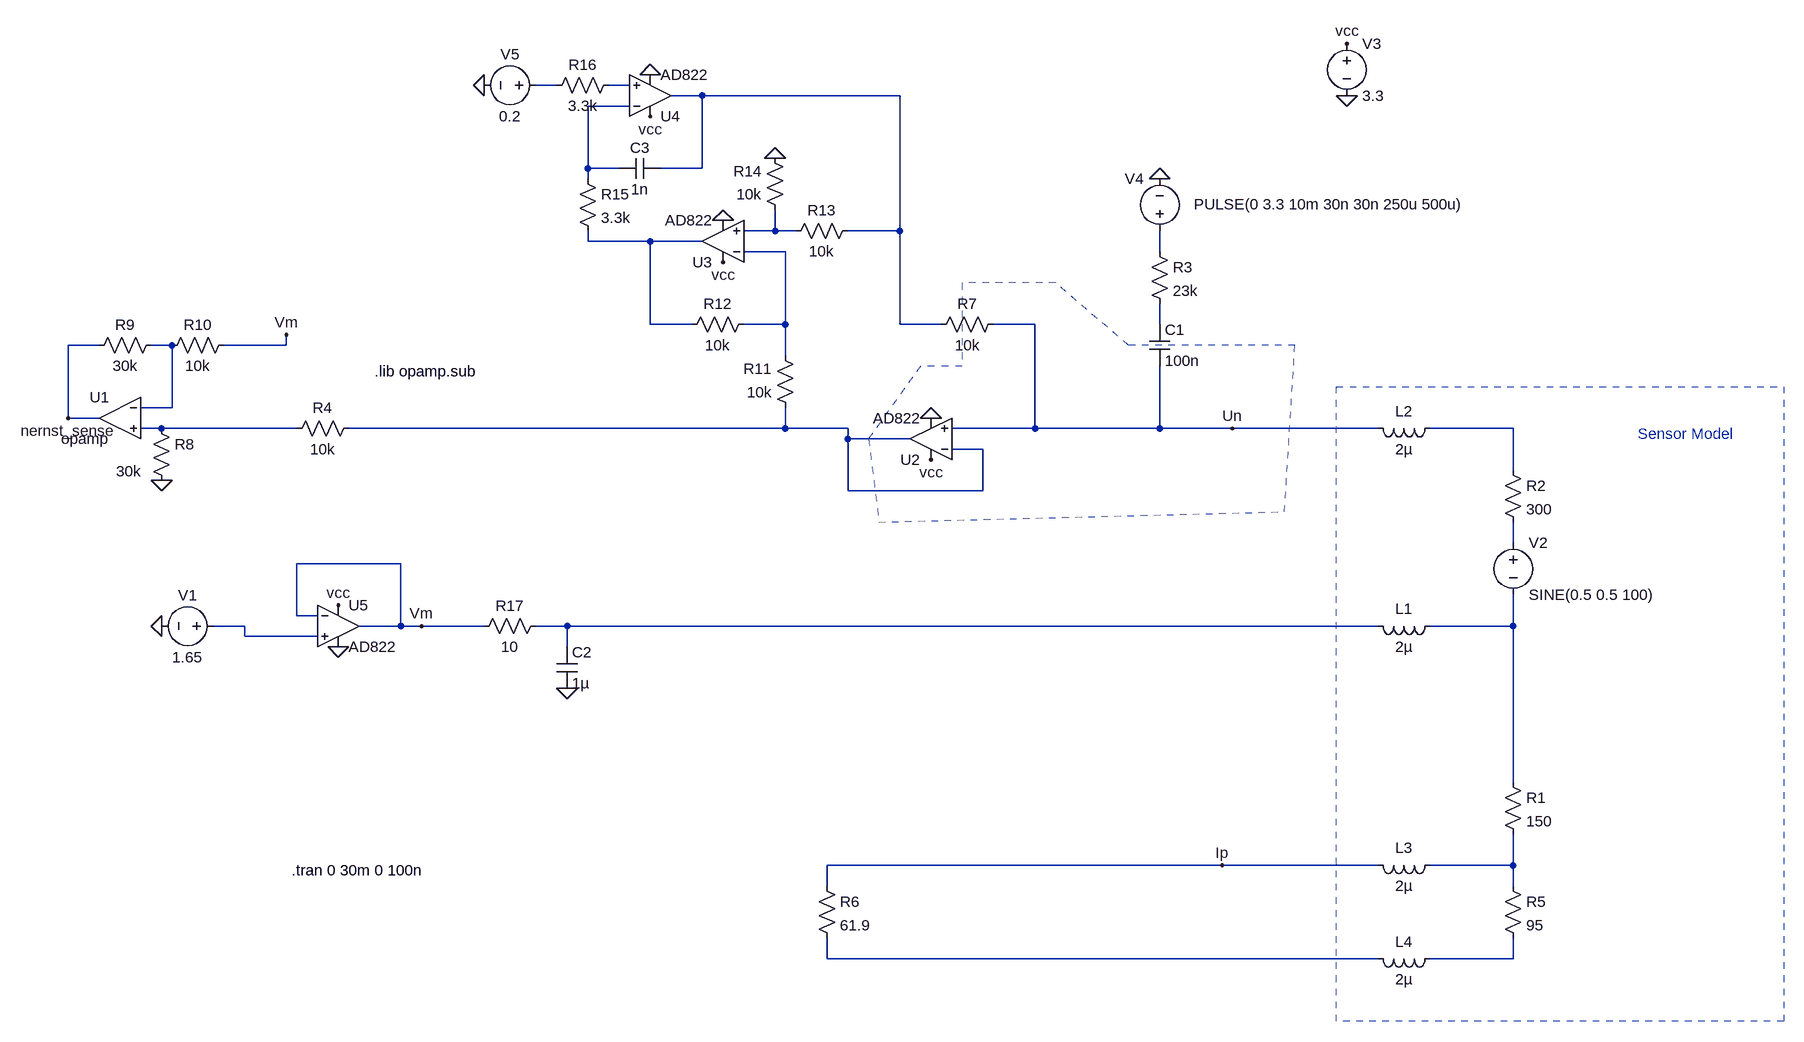
[diagram p0: schematic NernstSenseModel.asc]
NernstSenseModel.asc, the LTspice schematic file:
Version 4
SHEET 1 2244 772
WIRE 352 -672 320 -672
WIRE 464 -672 432 -672
WIRE 576 -656 528 -656
WIRE 880 -656 576 -656
WIRE 464 -640 400 -640
WIRE 400 -544 400 -640
WIRE 448 -544 400 -544
WIRE 576 -544 576 -656
WIRE 576 -544 512 -544
WIRE 400 -528 400 -544
WIRE 688 -448 688 -480
WIRE 688 -448 640 -448
WIRE 720 -448 688 -448
WIRE 880 -448 880 -656
WIRE 880 -448 800 -448
WIRE 400 -432 400 -448
WIRE 496 -432 400 -432
WIRE 576 -432 496 -432
WIRE 704 -416 640 -416
WIRE 1280 -416 1280 -448
WIRE 496 -304 496 -432
WIRE 560 -304 496 -304
WIRE 704 -304 704 -416
WIRE 704 -304 640 -304
WIRE 880 -304 880 -448
WIRE 944 -304 880 -304
WIRE 1088 -304 1024 -304
WIRE 1280 -304 1280 -336
WIRE -352 -272 -400 -272
WIRE -240 -272 -272 -272
WIRE -64 -272 -64 -288
WIRE -64 -272 -160 -272
WIRE 704 -256 704 -304
WIRE -240 -176 -240 -272
WIRE -240 -176 -288 -176
WIRE -400 -160 -400 -272
WIRE -352 -160 -400 -160
WIRE -256 -144 -288 -144
WIRE -48 -144 -256 -144
WIRE 704 -144 704 -176
WIRE 704 -144 32 -144
WIRE 800 -144 704 -144
WIRE 1088 -144 1088 -304
WIRE 1088 -144 960 -144
WIRE 1280 -144 1280 -240
WIRE 1280 -144 1088 -144
WIRE 1392 -144 1280 -144
WIRE 1616 -144 1392 -144
WIRE 1824 -144 1696 -144
WIRE 800 -128 800 -144
WIRE 896 -128 800 -128
WIRE 1008 -112 960 -112
WIRE 1824 -80 1824 -144
WIRE 800 -48 800 -128
WIRE 1008 -48 1008 -112
WIRE 1008 -48 800 -48
WIRE 1824 32 1824 0
WIRE 112 64 -48 64
WIRE -48 144 -48 64
WIRE -16 144 -48 144
WIRE -128 160 -176 160
WIRE 112 160 112 64
WIRE 112 160 48 160
WIRE 144 160 112 160
WIRE 240 160 144 160
WIRE 368 160 320 160
WIRE 1616 160 368 160
WIRE 1824 160 1824 112
WIRE 1824 160 1696 160
WIRE -128 176 -128 160
WIRE -16 176 -128 176
WIRE 368 192 368 160
WIRE 1824 400 1824 160
WIRE 1376 528 768 528
WIRE 1616 528 1376 528
WIRE 1824 528 1824 480
WIRE 1824 528 1696 528
WIRE 768 560 768 528
WIRE 1824 560 1824 528
WIRE 768 672 768 640
WIRE 1616 672 768 672
WIRE 1824 672 1824 640
WIRE 1824 672 1696 672
FLAG -256 160 0
FLAG 1280 -528 0
FLAG 1392 -144 Un
FLAG 1376 528 Ip
FLAG -64 -288 Vm
FLAG -256 -64 0
FLAG -400 -160 nernst_sense
FLAG 1568 -656 0
FLAG 1568 -736 vcc
FLAG 928 -96 vcc
FLAG 928 -160 0
FLAG 496 -688 0
FLAG 688 -560 0
FLAG 240 -672 0
FLAG 496 -624 vcc
FLAG 608 -400 vcc
FLAG 608 -464 0
FLAG 144 160 Vm
FLAG 368 256 0
FLAG 16 192 0
FLAG 16 128 vcc
SYMBOL voltage -160 160 R90
WINDOW 0 -32 56 VBottom 2
WINDOW 3 32 56 VTop 2
WINDOW 123 0 0 Left 0
WINDOW 39 0 0 Left 0
SYMATTR InstName V1
SYMATTR Value 1.65
SYMBOL res 1808 384 R0
SYMATTR InstName R1
SYMATTR Value 150
SYMBOL voltage 1824 16 R0
WINDOW 123 0 0 Left 0
WINDOW 39 0 0 Left 0
SYMATTR InstName V2
SYMATTR Value SINE(0.5 0.5 100)
SYMBOL res 1808 -96 R0
SYMATTR InstName R2
SYMATTR Value 300
SYMBOL cap 1264 -304 R0
SYMATTR InstName C1
SYMATTR Value 100n
SYMBOL res 1264 -432 R0
SYMATTR InstName R3
SYMATTR Value 23k
SYMBOL voltage 1280 -432 R180
WINDOW 0 24 96 Left 2
WINDOW 3 -471 57 Left 2
WINDOW 123 0 0 Left 0
WINDOW 39 0 0 Left 0
SYMATTR InstName V4
SYMATTR Value PULSE(0 3.3 10m 30n 30n 250u 500u)
SYMBOL res 1808 544 R0
SYMATTR InstName R5
SYMATTR Value 95
SYMBOL res 752 544 R0
SYMATTR InstName R6
SYMATTR Value 61.9
SYMBOL Opamps\\opamp -320 -224 M0
SYMATTR InstName U1
SYMBOL res 48 -160 R90
WINDOW 0 0 56 VBottom 2
WINDOW 3 32 56 VTop 2
SYMATTR InstName R4
SYMATTR Value 10k
SYMBOL res -272 -160 R0
WINDOW 3 -54 82 Left 2
SYMATTR Value 30k
SYMATTR InstName R8
SYMBOL res -256 -288 R90
WINDOW 0 0 56 VBottom 2
WINDOW 3 32 56 VTop 2
SYMATTR InstName R9
SYMATTR Value 30k
SYMBOL res -144 -288 R90
WINDOW 0 0 56 VBottom 2
WINDOW 3 32 56 VTop 2
SYMATTR InstName R10
SYMATTR Value 10k
SYMBOL ind 1712 144 R90
WINDOW 0 5 56 VBottom 2
WINDOW 3 32 56 VTop 2
SYMATTR InstName L1
SYMATTR Value 2µ
SYMBOL ind 1712 -160 R90
WINDOW 0 5 56 VBottom 2
WINDOW 3 32 56 VTop 2
SYMATTR InstName L2
SYMATTR Value 2µ
SYMBOL ind 1712 512 R90
WINDOW 0 5 56 VBottom 2
WINDOW 3 32 56 VTop 2
SYMATTR InstName L3
SYMATTR Value 2µ
SYMBOL ind 1712 656 R90
WINDOW 0 5 56 VBottom 2
WINDOW 3 32 56 VTop 2
SYMATTR InstName L4
SYMATTR Value 2µ
SYMBOL voltage 1568 -752 R0
WINDOW 123 0 0 Left 0
WINDOW 39 0 0 Left 0
SYMATTR InstName V3
SYMATTR Value 3.3
SYMBOL Opamps\\AD822 928 -64 R180
SYMATTR InstName U2
SYMBOL res 1040 -320 R90
WINDOW 0 0 56 VBottom 2
WINDOW 3 32 56 VTop 2
SYMATTR InstName R7
SYMATTR Value 10k
SYMBOL res 720 -160 R180
WINDOW 0 36 76 Left 2
WINDOW 3 36 40 Left 2
SYMATTR InstName R11
SYMATTR Value 10k
SYMBOL res 544 -288 R270
WINDOW 0 32 56 VTop 2
WINDOW 3 0 56 VBottom 2
SYMATTR InstName R12
SYMATTR Value 10k
SYMBOL Opamps\\AD822 608 -368 R180
SYMATTR InstName U3
SYMBOL res 816 -464 R90
WINDOW 0 0 56 VBottom 2
WINDOW 3 32 56 VTop 2
SYMATTR InstName R13
SYMATTR Value 10k
SYMBOL res 704 -464 R180
WINDOW 0 36 76 Left 2
WINDOW 3 36 40 Left 2
SYMATTR InstName R14
SYMATTR Value 10k
SYMBOL Opamps\\AD822 496 -592 M180
SYMATTR InstName U4
SYMBOL cap 512 -560 R90
WINDOW 0 0 32 VBottom 2
WINDOW 3 32 32 VTop 2
SYMATTR InstName C3
SYMATTR Value 1n
SYMBOL res 384 -544 R0
SYMATTR InstName R15
SYMATTR Value 3.3k
SYMBOL voltage 336 -672 R90
WINDOW 0 -32 56 VBottom 2
WINDOW 3 32 56 VTop 2
WINDOW 123 0 0 Left 0
WINDOW 39 0 0 Left 0
SYMATTR InstName V5
SYMATTR Value 0.2
SYMBOL res 336 144 R90
WINDOW 0 0 56 VBottom 2
WINDOW 3 32 56 VTop 2
SYMATTR InstName R17
SYMATTR Value 10
SYMBOL res 448 -688 R90
WINDOW 0 0 56 VBottom 2
WINDOW 3 32 56 VTop 2
SYMATTR InstName R16
SYMATTR Value 3.3k
SYMBOL cap 352 192 R0
SYMATTR InstName C2
SYMATTR Value 1µ
SYMBOL Opamps\\AD822 16 96 R0
SYMATTR InstName U5
TEXT -56 536 Left 2 !.tran 0 30m 0 100n
TEXT 72 -232 Left 2 !.lib opamp.sub
TEXT 2016 -136 Left 2 ;Sensor Model
LINE Normal 912 -240 832 -128 2
LINE Normal 976 -240 912 -240 2
LINE Normal 976 -368 976 -240 2
LINE Normal 1120 -368 976 -368 2
LINE Normal 1232 -272 1120 -368 2
LINE Normal 1488 -272 1232 -272 2
LINE Normal 1472 -16 1488 -272 2
LINE Normal 848 0 1472 -16 2
LINE Normal 832 -128 848 0 2
RECTANGLE Normal 2240 768 1552 -208 2

The netlist it stands for:
* NernstSenseModel.asc
V1 N015 0 1.65
R1 N017 N018 150
V2 N014 N017 SINE(0.5 0.5 100)
R2 N013 N014 300
C1 N009 Un 100n
R3 N008 N009 23k
V4 N008 0 PULSE(0 3.3 10m 30n 30n 250u 500u)
R5 N018 N020 95
R6 Ip N019 61.9
XU1 N010 N011 nernst_sense opamp Aol=100K GBW=10Meg  ; pins invin noninvin out
R4 N012 N011 10k
R8 N011 0 30k
R9 N010 nernst_sense 30k
R10 Vm N010 10k
L1 N017 N016 2µ
L2 N013 Un 2µ
L3 N018 Ip 2µ
L4 N020 N019 2µ
V3 vcc 0 3.3
XU2 Un N012 vcc 0 N012 AD822  ; pins In+ In- V+ V- OUT
R7 Un N003 10k
R11 N012 N007 10k
R12 N006 N007 10k
XU3 N005 N007 vcc 0 N006 AD822  ; pins In+ In- V+ V- OUT
R13 N003 N005 10k
R14 N005 0 10k
XU4 N002 N004 vcc 0 N003 AD822  ; pins In+ In- V+ V- OUT
C3 N003 N004 1n
R15 N004 N006 3.3k
V5 N001 0 0.2
R17 N016 Vm 10
R16 N002 N001 3.3k
C2 N016 0 1µ
XU5 N015 Vm vcc 0 Vm AD822  ; pins In+ In- V+ V- OUT
.tran 0 30m 0 100n
.lib opamp.sub
* Sensor Model
.backanno
.end